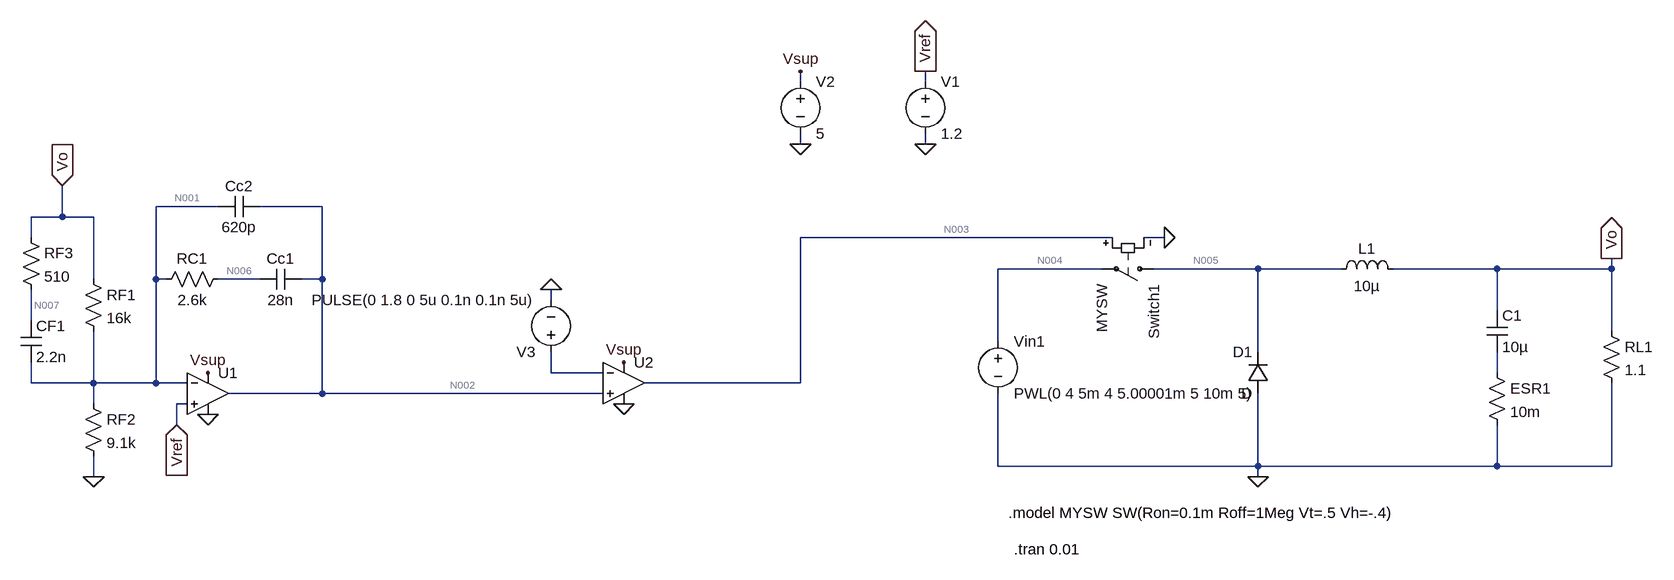
[diagram p0: schematic Buck_Controller_Modeling_25kHz.asc]
Buck_Controller_Modeling_25kHz.asc, the LTspice schematic file:
Version 4
SHEET 1 1000 680
WIRE -320 -224 -320 -240
WIRE -128 -224 -128 -240
WIRE -320 -128 -320 -144
WIRE -128 -128 -128 -144
WIRE -1216 -32 -1312 -32
WIRE -1056 -32 -1152 -32
WIRE -1456 -16 -1456 -64
WIRE -1456 -16 -1504 -16
WIRE -1408 -16 -1456 -16
WIRE -1504 16 -1504 -16
WIRE 160 16 -320 16
WIRE 240 16 208 16
WIRE 144 64 -16 64
WIRE 384 64 224 64
WIRE 512 64 384 64
WIRE 752 64 592 64
WIRE 928 64 928 48
WIRE 928 64 752 64
WIRE -1408 80 -1408 -16
WIRE -1312 80 -1312 -32
WIRE -1296 80 -1312 80
WIRE -1152 80 -1216 80
WIRE -1056 80 -1056 -32
WIRE -1056 80 -1088 80
WIRE -704 112 -704 96
WIRE 752 128 752 64
WIRE -1504 144 -1504 96
WIRE 928 160 928 64
WIRE -16 176 -16 64
WIRE 384 192 384 64
WIRE -704 224 -704 192
WIRE -624 224 -704 224
WIRE 752 224 752 192
WIRE -1504 240 -1504 208
WIRE -1408 240 -1408 160
WIRE -1408 240 -1504 240
WIRE -1312 240 -1312 80
WIRE -1312 240 -1408 240
WIRE -1264 240 -1312 240
WIRE -320 240 -320 16
WIRE -320 240 -560 240
WIRE -1056 256 -1056 80
WIRE -1056 256 -1200 256
WIRE -624 256 -1056 256
WIRE -1408 272 -1408 240
WIRE -1264 272 -1280 272
WIRE -1280 304 -1280 272
WIRE -16 368 -16 256
WIRE 384 368 384 256
WIRE 384 368 -16 368
WIRE 752 368 752 304
WIRE 752 368 384 368
WIRE 928 368 928 240
WIRE 928 368 752 368
WIRE -1408 384 -1408 352
WIRE 384 384 384 368
FLAG 384 384 0
FLAG 928 48 Vo
IOPIN 928 48 Out
FLAG -128 -128 0
FLAG -128 -240 Vref
IOPIN -128 -240 Out
FLAG -1408 384 0
FLAG -1280 304 Vref
IOPIN -1280 304 In
FLAG -320 -128 0
FLAG -320 -240 Vsup
FLAG -1232 224 Vsup
FLAG -1232 288 0
FLAG -704 96 0
FLAG -592 208 Vsup
FLAG -592 272 0
FLAG 240 16 0
FLAG -1456 -64 Vo
IOPIN -1456 -64 In
SYMBOL voltage -16 160 R0
WINDOW 123 0 0 Left 0
WINDOW 39 0 0 Left 0
SYMATTR InstName Vin1
SYMATTR Value PWL(0 4 5m 4 5.00001m 5 10m 5)
SYMBOL sw 240 64 R90
SYMATTR InstName Switch1
SYMATTR Value MYSW
SYMBOL diode 400 256 R180
WINDOW 0 24 64 Left 2
WINDOW 3 24 0 Left 2
SYMATTR InstName D1
SYMBOL ind 496 80 R270
WINDOW 0 32 56 VTop 2
WINDOW 3 5 56 VBottom 2
SYMATTR InstName L1
SYMATTR Value 10µ
SYMBOL cap 736 128 R0
SYMATTR InstName C1
SYMATTR Value 10µ
SYMBOL res 736 208 R0
SYMATTR InstName ESR1
SYMATTR Value 10m
SYMBOL res 912 144 R0
SYMATTR InstName RL1
SYMATTR Value 1.1
SYMBOL Opamps\\UniversalOpamp2 -1232 256 R0
SYMATTR InstName U1
SYMBOL voltage -128 -240 R0
SYMATTR InstName V1
SYMATTR Value 1.2
SYMBOL res -1520 0 R0
SYMATTR InstName RF3
SYMATTR Value 510
SYMBOL res -1424 64 R0
SYMATTR InstName RF1
SYMATTR Value 16k
SYMBOL cap -1520 144 R0
SYMATTR InstName CF1
SYMATTR Value 2.2n
SYMBOL res -1424 256 R0
SYMATTR InstName RF2
SYMATTR Value 9.1k
SYMBOL res -1200 64 R90
WINDOW 0 0 56 VBottom 2
WINDOW 3 32 56 VTop 2
SYMATTR InstName RC1
SYMATTR Value 2.6k
SYMBOL cap -1088 64 R90
WINDOW 0 0 32 VBottom 2
WINDOW 3 32 32 VTop 2
SYMATTR InstName Cc1
SYMATTR Value 28n
SYMBOL cap -1152 -48 R90
WINDOW 0 0 32 VBottom 2
WINDOW 3 32 32 VTop 2
SYMATTR InstName Cc2
SYMATTR Value 620p
SYMBOL voltage -320 -240 R0
WINDOW 123 0 0 Left 0
WINDOW 39 0 0 Left 0
SYMATTR InstName V2
SYMATTR Value 5
SYMBOL Opamps\\UniversalOpamp2 -592 240 R0
SYMATTR InstName U2
SYMBOL voltage -704 208 R180
WINDOW 123 0 0 Left 0
WINDOW 39 0 0 Left 0
SYMATTR InstName V3
SYMATTR Value PULSE(0 1.8 0 5u 0.1n 0.1n 5u)
TEXT 8 496 Left 2 !.tran 0.01
TEXT 0 440 Left 2 !.model MYSW SW(Ron=0.1m Roff=1Meg Vt=.5 Vh=-.4)

The netlist it stands for:
* Buck_Controller_Modeling_25kHz.asc
Vin1 N004 0 PWL(0 4 5m 4 5.00001m 5 10m 5)
Switch1 N005 N004 N003 0 MYSW
D1 0 N005 D
L1 N005 Vo 10µ
C1 Vo N009 10µ
R§ESR1 N009 0 10m
RL1 Vo 0 1.1
XU1 Vref N001 Vsup 0 N002 level.2 Avol=1Meg GBW=10Meg Slew=10Meg ilimit=25m rail=0 Vos=0 phimargin=45 en=0 enk=0 in=0 ink=0 Rin=500Meg  ; pins IN+ IN- V+ V- OUT
V1 Vref 0 1.2
RF3 Vo N007 510
RF1 Vo N001 16k
CF1 N007 N001 2.2n
RF2 N001 0 9.1k
RC1 N006 N001 2.6k
Cc1 N002 N006 28n
Cc2 N002 N001 620p
V2 Vsup 0 5
XU2 N002 N008 Vsup 0 N003 level.2 Avol=1Meg GBW=10Meg Slew=10Meg ilimit=25m rail=0 Vos=0 phimargin=45 en=0 enk=0 in=0 ink=0 Rin=500Meg  ; pins IN+ IN- V+ V- OUT
V3 N008 0 PULSE(0 1.8 0 5u 0.1n 0.1n 5u)
.model D D
.lib standard.dio
.tran 0.01
.model MYSW SW(Ron=0.1m Roff=1Meg Vt=.5 Vh=-.4)
.lib UniversalOpamps2.sub
.backanno
.end

* Results of the author's LTspice run, read from the files saved beside the schematic
* Operating Point, zero values left out:
*   V(n004) = 4 V
*   V(n005) = 4 V
*   V(n003) = 4.944 V
*   V(vo) = 3.996 V
*   V(n002) = 6.114 µV
*   V(vsup) = 5 V
*   V(n001) = 1.449 V
*   V(vref) = 1.2 V
*   V(n007) = 3.996 V
*   V(n006) = 1.449 V
*   I(D1) = -4.01 pA
*   I(L1) = 3.633 A
*   I(Rf2) = 159.2 µA
*   I(Rf1) = 159.2 µA
*   I(Rl1) = 3.633 A
*   I(Switch1) = 3.633 A
*   I(V3) = 5 nA
*   I(V2) = -53.14 µA
*   I(V1) = 2.6 nA
*   I(Vin1) = -3.633 A
*   Ix(u1:1) = -2.6 nA
*   Ix(u1:2) = -2.102 nA
*   Ix(u1:3) = 605.6 nA
*   Ix(u1:4) = -535.1 nA
*   Ix(u1:5) = 5 nA
*   Ix(u2:1) = -5 nA
*   Ix(u2:2) = -5 nA
*   Ix(u2:3) = 52.54 µA
*   Ix(u2:4) = -52.55 µA